# Altium schematic sheet M12_Connector.SchDoc
size A4; DocumentNumber: 1; SheetNumber: 2; SheetTotal: 11
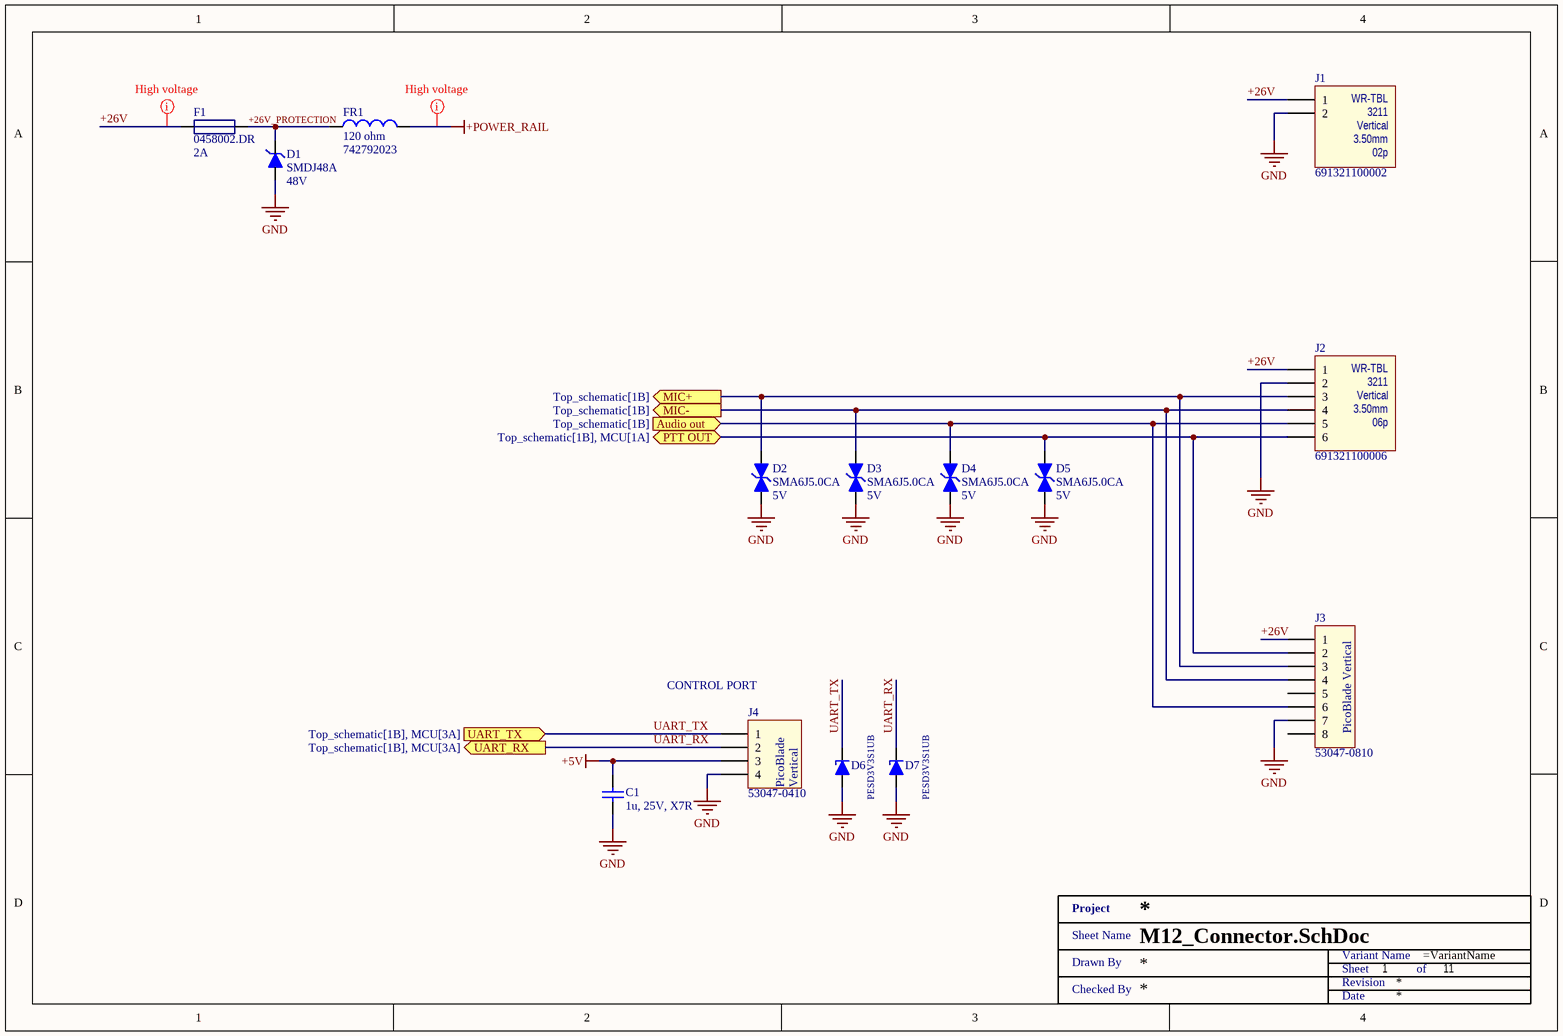
[diagram p0: M12_Connector.SchDoc]

## Parts
C1  1u, 25V, X7R  [SMD0603]
D1  SMDJ48A  Reverse Standoff Voltage: 48V  [DO-214AB]
D2  SMA6J5.0CA  Reverse Standoff Voltage: 5V  [DO-214AC]
D3  SMA6J5.0CA  Reverse Standoff Voltage: 5V  [DO-214AC]
D4  SMA6J5.0CA  Reverse Standoff Voltage: 5V  [DO-214AC]
D5  SMA6J5.0CA  Reverse Standoff Voltage: 5V  [DO-214AC]
D6  PESD3V3S1UB  [SOD523]
D7  PESD3V3S1UB  [SOD523]
F1  0458002.DR  Current Rating: 2A  [SMD1206 - FUSE]
FR1  120 ohm  [SMD0805 - R]
J1  691321100002  [691321100002]
J2  691321100006  [691321100006]
J3  53047-0810  [530470810]
J4  53047-0410  [530470410]
XX?  Title 1  (value not drawn)  (graphical)

## Ports
Audio out (in, see Top_schematic[1B]), MIC+ (out, see Top_schematic[1B]), MIC- (out, see Top_schematic[1B]), PTT OUT (bidir, see Top_schematic[1B], MCU[1A]), UART_RX (out, see Top_schematic[1B], MCU[3A]), UART_TX (in, see Top_schematic[1B], MCU[3A])

## Nets
+5V: C1.1 J4.3
+POWER_RAIL: FR1.2
GND: C1.2 D1.2 D2.1(A) D3.1(A) D4.1(A) D5.1(A) D6.2(K) D7.2(K) J1.2 J2.2 J3.7 J4.4
+26V: F1.1 J1.1 J2.1 J3.1
+26V_PROTECTION: D1.1 F1.2 FR1.1
Audio out: D4.2(K) J2.5 J3.6 ; port Audio out
MIC+: D2.2(K) J2.3 J3.3 ; port MIC+
MIC-: D3.2(K) J2.4 J3.4 ; port MIC-
PTT OUT: D5.2(K) J2.6 J3.2 ; port PTT OUT
UART_RX: D7.1(A) J4.2 ; port UART_RX
UART_TX: D6.1(A) J4.1 ; port UART_TX

Not connected (* = marked no-connect by the designer): J3 5 8

## Layout directives
net class HV: +26V, +POWER_RAIL

## Notes on the sheet
- (near J4) CONTROL PORT
- (in symbol 53047-0410) PicoBlade; Vertical
- (in symbol 53047-0810) PicoBlade Vertical
- (in symbol 691321100002) WR-TBL; 3211; 3.50mm; 02p
- (in symbol 691321100006) WR-TBL; 3211; 3.50mm; 06p
- (in symbol Title 1) Project; Sheet Name; Variant Name; Drawn By; Sheet; of; Revision; Checked By; Date

## Library data of the parts
C1 = CGA3E1X7R1E105K080AC: CAP CER 1UF 25V X7R 0603; Manufacturer: TDK Corporation; Tolerance: ±10%; Manufacturer Part Number: CGA3E1X7R1E105K080AC; RoHS: RoHS Compliant; Category: Capacitors; Stock 1: 109509; Pricing 1: 1=0.2, 10=0.135, 100=0.0686, 500=0.04696, 1000=0.04154 (USD); Packaging: Cut Tape (CT); Part Status: Active; Voltage - Rated: 25V; Temperature Coefficient: X7R; Operating Temperature: -55°C ~ 125°C; Features: -; Ratings: AEC-Q200; Applications: Automotive; Failure Rate: -; Mounting Type: Surface Mount, MLCC; Package / Case: 0603 (1608 Metric); Size / Dimension: 0.063" L x 0.032" W (1.60mm x 0.80mm); Height - Seated (Max): -; Thickness (Max): 0.035" (0.90mm); Lead Spacing: -; Lead Style: -; ComponentLink1URL: https://product.tdk.com/info/en/catalog/datasheets/mlcc_automotive_general_en.pdf; ComponentLink1Description: https://product.tdk.com/info/en/catalog/datasheets/mlcc_automotive_general_en.pdf; Capacitance: 1u; Supplier 1: Mouser; Supplier Part Number 1: 810-CGA3E1X7R1E105K; Supplier 2: Farnell; Supplier Part Number 2: 2346962; Supplier 3: Digi-Key; Supplier Part Number 3: 445-6931-1-ND
D1 = SMDJ48A: J Series 53.3 V 3000 W Surface Mount Uni-Directional TVS Diode - DO-214AB; Manufacturer: Littelfuse; Supplier 1: Mouser; Supplier Part Number 1: 576-SMDJ48A; Manufacturer Part Number: SMDJ48A; RoHS: Yes; Category: TVS Diodes; Stock 1: 11613; Pricing 1: 1=1.02, 10=0.889, 50=0.889, 100=0.688, 1000=0.471, 10000=0.408 (USD); ComponentLink1URL: https://datasheet.ciiva.com/16487/littelfuse-tvs-diodes-smdj-16487926.pdf?src-supplier=Future+Electronics; ComponentLink1Description: https://datasheet.ciiva.com/16487/littelfuse-tvs-diodes-smdj-16487926.pdf?src-supplier=Future+Electronics; ComponentLink2URL: https://datasheet.ciiva.com/332/littelfuse-tvs-diode-smdj-datasheet-pdf-332813.pdf?src-supplier=Digi-Key; ComponentLink2Description: https://datasheet.ciiva.com/332/littelfuse-tvs-diode-smdj-datasheet-pdf-332813.pdf?src-supplier=Digi-Key; ComponentLink3URL: https://datasheet.ciiva.com/332/littelfuse-tvs-diode-smdj-datasheet-pdf-332814.pdf?src-supplier=Digi-Key; ComponentLink3Description: https://datasheet.ciiva.com/332/littelfuse-tvs-diode-smdj-datasheet-pdf-332814.pdf?src-supplier=Digi-Key; ComponentLink4URL: https://datasheet.ciiva.com/332/littelfuse-tvs-diode-smdj-datasheet-pdf-332815.pdf?src-supplier=Digi-Key; ComponentLink4Description: https://datasheet.ciiva.com/332/littelfuse-tvs-diode-smdj-datasheet-pdf-332815.pdf?src-supplier=Digi-Key; Supplier 2: Farnell; Supplier Part Number 2: 2762843; Supplier 3: Digi-Key; Supplier Part Number 3: SMDJ48ACT-ND
D2-D5 = SMA6J5.0CA: ESD Suppressors / TVS Diodes 600W 5V 5% Bi-Directional; Manufacturer: Littelfuse; Supplier 1: Mouser; Supplier Part Number 1: 576-SMA6J5.0CA; Manufacturer Part Number: SMA6J5.0CA; RoHS: Yes; Category: TVS Diodes; Stock 1: 57321; Pricing 1: 1=0.41, 10=0.35, 50=0.35, 100=0.243, 1000=0.139, 10000=0.115 (USD); ComponentLink1URL: http://www.farnell.com/datasheets/2736094.pdf?src-supplier=Farnell; ComponentLink1Description: http://www.farnell.com/datasheets/2736094.pdf?src-supplier=Farnell; ComponentLink2URL: https://datasheet.octopart.com/SMA6J5.0CA-Littelfuse-datasheet-114785799.pdf?src-supplier=Future+Electronics; ComponentLink2Description: https://datasheet.octopart.com/SMA6J5.0CA-Littelfuse-datasheet-114785799.pdf?src-supplier=Future+Electronics; ComponentLink3URL: https://www.littelfuse.com/~/media/electronics/datasheets/tvs_diodes/littelfuse_tvs_diode_sma6j_datasheet.pdf.pdf?src-supplier=Digi-Key; ComponentLink3Description: https://www.littelfuse.com/~/media/electronics/datasheets/tvs_diodes/littelfuse_tvs_diode_sma6j_datasheet.pdf.pdf?src-supplier=Digi-Key; ComponentLink4URL: http://www.farnell.com/datasheets/2736094.pdf?src-supplier=Newark; ComponentLink4Description: http://www.farnell.com/datasheets/2736094.pdf?src-supplier=Newark; ComponentLink5URL: http://www.farnell.com/datasheets/2736094.pdf?src-supplier=Element14; ComponentLink5Description: http://www.farnell.com/datasheets/2736094.pdf?src-supplier=Element14; Supplier 2: Farnell; Supplier Part Number 2: 3010381; Supplier 3: Digi-Key; Supplier Part Number 3: 18-SMA6J5.0CACT-ND
D6 D7 = PESD3V3S1UB,115: TVS DIODE 3.3V 20V SOD523; Manufacturer: Nexperia USA Inc.; Type: Zener; Voltage - Reverse Standoff (Typ): 3.3V (Max); Voltage - Breakdown (Min): 5.2V; Current - Peak Pulse (10/1000µs): 18A (8/20µs); Power - Peak Pulse: 330W; Power Line Protection: No; Capacitance @ Frequency: 207pF @ 1MHz; Manufacturer Part Number: PESD3V3S1UB,115; RoHS: RoHS Compliant; Category: Circuit Protection; Stock 1: 0; Pricing 1: 1=0.49, 10=0.368, 100=0.2082, 500=0.1379, 1000=0.10573 (USD); Packaging: Cut Tape (CT); Part Status: Active; Voltage - Clamping (Max) @ Ipp: 20V; Applications: General Purpose; Operating Temperature: -65°C ~ 150°C (TA); Mounting Type: Surface Mount; Package / Case: SC-79, SOD-523; Supplier Device Package: SOD-523; Base Part Number: PESD*S1U; ComponentLink1URL: https://assets.nexperia.com/documents/data-sheet/PESDXS1UB_SERIES.pdf; ComponentLink1Description: https://assets.nexperia.com/documents/data-sheet/PESDXS1UB_SERIES.pdf; Supplier 1: Mouser; Supplier Part Number 1: 771-PESD3V3S1UB-T/R; Supplier 2: Farnell; Supplier Part Number 2: 8737568; Supplier 3: Digi-Key; Supplier Part Number 3: 1727-3829-1-ND; Supplier 4: TME; Supplier Part Number 4: PESD3V3S1UB.115
F1 = 0458002.DR: FUSE BRD MNT 2A 48VAC 75VDC 1206; Manufacturer: Littelfuse; Body Material: Ceramic; Voltage Rating (AC): 48V; Voltage Rating (DC): 75V; Resistance: 69.5mR; DC Cold Resistance: 63.5mR; Fuse Type: Board Mount (Cartridge Style Excluded); Voltage Rating: 63V; Approvals: cULus; Supplier 1: Mouser; Supplier Part Number 1: 576-0458002.DR; Manufacturer Part Number: 0458002.DR; Stock 1: 11466; Pricing 1: 1 = 1.31000, 10 = 0.97500, 50 = 0.97500, 100 = 0.81200, 1000 = 0.67000, 10000 = 0.50800 (USD); RoHS: Yes; Mount: Surface Mount; Case/Package: 1206; Case Code (Metric): 3216; Case Code (Imperial): 1206; Housing Material: Ceramic; Min Operating Temperature: -55°C; Max Operating Temperature: 125°C; Packaging: Tape and Reel; Package Quantity: 1500; Fuse Current: 2A; Termination: SMD/SMT; Working Voltage: 63V; Length: 0.125inch; Height: 0.062inch; Width: 1.575mm; Depth: 1.58mm; REACH SVHC: No SVHC; Lead Free: Lead Free; ComponentLink1URL: https://datasheet.ciiva.com/1730/337915-1730544.pdf?src-supplier=Newark; ComponentLink1Description: https://datasheet.ciiva.com/1730/337915-1730544.pdf?src-supplier=Newark; ComponentLink2URL: https://datasheet.ciiva.com/299/littelfuse-fuse-458-series-299804.pdf?src-supplier=Digi-Key; ComponentLink2Description: https://datasheet.ciiva.com/299/littelfuse-fuse-458-series-299804.pdf?src-supplier=Digi-Key; ComponentLink3URL: https://datasheet.ciiva.com/299/littelfuse-fuse-458-series-299805.pdf?src-supplier=Digi-Key; ComponentLink3Description: https://datasheet.ciiva.com/299/littelfuse-fuse-458-series-299805.pdf?src-supplier=Digi-Key; ComponentLink4URL: https://datasheet.ciiva.com/299/littelfuse-fuse-458-series-299806.pdf?src-supplier=Digi-Key; ComponentLink4Description: https://datasheet.ciiva.com/299/littelfuse-fuse-458-series-299806.pdf?src-supplier=Digi-Key; Supplier 2: Farnell; Supplier Part Number 2: 1702533; Stock 2: 1620; Supplier 3: Digi-Key; Supplier Part Number 3: F2931CT-ND; Stock 3: 14221; Pricing 3: 1 = 1.43000, 5 = 1.38400, 10 = 1.29500, 50 = 1.07180, 100 = 0.89320, 250 = 0.87088, 500 = 0.73690 (USD)
FR1 = 742792023: WURTH ELEKTRONIK - 742792023 - FERRITE BEAD, 0.03OHM, 3A, 0805; Impedance @ 100MHz: 120; Ferrite Case Style: 0805 [2012 Metric]; DC Current Rating: 3; DC Resistance Max: 0.03; Impedance Tolerance: ± 25%; Ferrite Mounting: SMD; Resistance: 0.03ohm<!--FANDB--><div class="features-and-benefits-container"><div class="features-and-benefits-description"><span class="features-benefits-value">The 742792023 is a SMD EMI Suppression Ferrite Bead with 0805 case and reliable Ni-Sn electrodes. It can be put directly on the printed circuit board. It offers excellent anti-EMI properties and low DC resistance. Placed very close next to the interference source even with smallest size 0402, maximal impedance at 1000; Manufacturer: WURTH ELEKTRONIK; RoHS: YES; Stock 1: 4283; Pricing 1: 1=0,123, 50=0,112, 100=0,103, 500=0,0937, 1000=0,0877, 2000=0,0846 (GBP); Product Range: -; Automotive Qualification Standard: -; Packaging: Cut Tape; ComponentLink1URL: http://www.farnell.com/datasheets/1695980.pdf; ComponentLink1Description: http://www.farnell.com/datasheets/1695980.pdf; ComponentLink2URL: http://www.farnell.com/cad/1670054.zip; ComponentLink2Description: http://www.farnell.com/cad/1670054.zip; Supplier 1: Mouser; Supplier Part Number 1: 710-742792023; Supplier 2: Farnell; Supplier Part Number 2: 1635732; Supplier 3: Digi-Key; Supplier Part Number 3: 732-1613-1-ND; Manufacturer Part Number: 742792023
J1 = 691321100002: WR-TBL Series 3211 - 3.50 mm Vertical PCB Header; Manufacturer: Wurth Electronics; Description: Barrier Strip Terminal Block, 10A, 1 Row(s), 1 Deck(s); Number of Positions Per Level: 2; Number of Levels: 1; Current: 10A; Voltage: 300V; Pitch: 0.138inch; Supplier: Mouser; Supplier Part Number: 710-691321100002; Manufacturer Part Number: 691321100002; RoHS: Yes; Category: Terminal Blocks; Stock: 2512; Pricing: 1=0.44, 10=0.394, 50=0.34, 100=0.305, 1000=0.269, 10000=0.268 (USD); Mounting Technology: Through Hole; Color: Green; Contact Material: Brass; Package Quantity: 1000; Packaging: Bulk; Number of Rows: 1; Termination: Solder; Number of Contacts: 2; Orientation: Vertical; Series: WR-TBL Series 3211; Voltage Rating: 300V; Length: 7mm; Width: 8.1mm; Height: 12.7mm; RoHS Compliant: Yes; Reach SVHC Compliant: Unknown; Lead Free: 5697LeadFree; ComponentLink1URL: https://datasheet.ciiva.com/8043/1442231-8043542.pdf?src-supplier=Element14; ComponentLink1Description: https://datasheet.ciiva.com/8043/1442231-8043542.pdf?src-supplier=Element14; ComponentLink2URL: https://datasheet.ciiva.com/795/6913211000xx-795780.pdf?src-supplier=Digikey; ComponentLink2Description: https://datasheet.ciiva.com/795/6913211000xx-795780.pdf?src-supplier=Digikey; ComponentLink3URL: https://datasheet.ciiva.com/48692/001088697-da-01-en-wr-tbl-terminal-block3211-691321100002-48692842.pdf?src-supplier=Conrad; ComponentLink3Description: https://datasheet.ciiva.com/48692/001088697-da-01-en-wr-tbl-terminal-block3211-691321100002-48692842.pdf?src-supplier=Conrad; Supplier 1: Mouser; Supplier Part Number 1: 710-691321100002; Supplier 2: Farnell; Supplier Part Number 2: 1841308; Supplier 3: Digikey; Supplier Part Number 3: 732-2763-ND
J2 = 691321100006: WR-TBL Series 3211 - 3.50 mm Vertical PCB Header; Manufacturer: Wurth Electronics; Description: Barrier Strip Terminal Block, 10A, 1 Row(s), 1 Deck(s); Current Rating: 10.5A; Number of Positions Per Level: 6; Number of Levels: 1; Current: 10A; Voltage: 300V; Pitch: 0.138inch; Supplier: Mouser; Supplier Part Number: 710-691321100006; Manufacturer Part Number: 691321100006; RoHS: Yes; Category: Terminal Blocks; Stock: 612; Pricing: 1=1.32, 10=1.18, 50=1.02, 100=0.914, 1000=0.805, 10000=0.804 (USD); Mounting Technology: Through Hole; Color: Green; Contact Material: Brass; Number of Rows: 1; Package Quantity: 520; Packaging: Bulk; Termination: Solder; Number of Contacts: 6; Contact Gender: Male; Orientation: Vertical; Series: WR-TBL Series 3211; Length: 7mm; Width: 25.6mm; Height: 12.7mm; RoHS Compliant: Yes; Reach SVHC Compliant: Unknown; ComponentLink1URL: https://datasheet.ciiva.com/8043/1442231-8043549.pdf?src-supplier=Element14; ComponentLink1Description: https://datasheet.ciiva.com/8043/1442231-8043549.pdf?src-supplier=Element14; ComponentLink2URL: https://datasheet.ciiva.com/796/6913211000xx-796060.pdf?src-supplier=Digikey; ComponentLink2Description: https://datasheet.ciiva.com/796/6913211000xx-796060.pdf?src-supplier=Digikey; ComponentLink3URL: https://datasheet.ciiva.com/48692/001088701-da-01-en-wr-tbl-terminal-block3211-691321100006-48692844.pdf?src-supplier=Conrad; ComponentLink3Description: https://datasheet.ciiva.com/48692/001088701-da-01-en-wr-tbl-terminal-block3211-691321100006-48692844.pdf?src-supplier=Conrad; Supplier 1: Mouser; Supplier Part Number 1: 710-691321100006; Supplier 2: Farnell; Supplier Part Number 2: 1841313; Supplier 3: Digikey; Supplier Part Number 3: 732-2767-ND
J3 = 53047-0810: 1.25mm Pitch, PicoBlade PCB Header, Single Row, Vertical, Through Hole, Tin Plating, Friction Lock, 8 Circuits, Tray, 2.30mm PC Tail Length; Manufacturer: Molex; Number of Contacts: 8; Contact Resistance: 20mR; Gender: Male; Current Rating: 1A; Voltage Rating: 125V; Insulation Resistance: 100MR; Glow Wire Compliant: Non-compliant; Supplier 1: Mouser; Supplier Part Number 1: 538-53047-0810; Manufacturer Part Number: 53047-0810; Stock 1: 13800; Pricing 1: 1 = 0.50000, 10 = 0.48300, 50 = 0.48300, 100 = 0.38300, 1000 = 0.29100, 10000 = 0.22600 (USD); RoHS: Yes; Mount: Through Hole; Case/Package: 0810; Contact Plating: Tin; Contact Material: Bronze; Color: Natural; Housing Color: Natural; Housing Material: Polyamide; Min Operating Temperature: -40°C; Max Operating Temperature: 85°C; Termination: Through Hole; Number of Rows: 1; Orientation: Vertical; Packaging: Tray; Number of Positions: 8; Package Quantity: 2000; Voltage Rating (DC): 125V; Number of Circuits: 8; Pitch: 1.25mm; Radiation Hardening: No; REACH SVHC: Unknown; Lead Free: Lead Free; Flammability Rating: UL94 V-0; ComponentLink1URL: https://datasheet.ciiva.com/30110/64290530470810-pcb-headers-30110449.pdf?src-supplier=Onlinecomponents.com; ComponentLink1Description: https://datasheet.ciiva.com/30110/64290530470810-pcb-headers-30110449.pdf?src-supplier=Onlinecomponents.com; ComponentLink2URL: https://datasheet.ciiva.com/5155/0530470810-pcb-headers-170988-5155236.pdf?src-supplier=Mouser; ComponentLink2Description: https://datasheet.ciiva.com/5155/0530470810-pcb-headers-170988-5155236.pdf?src-supplier=Mouser; ComponentLink3URL: https://datasheet.ciiva.com/11747/0900766b8024e2fd-11747012.pdf?src-supplier=RSComponents; ComponentLink3Description: https://datasheet.ciiva.com/11747/0900766b8024e2fd-11747012.pdf?src-supplier=RSComponents; ComponentLink4URL: https://datasheet.ciiva.com/25291/1815828-25291355.pdf?src-supplier=Newark; ComponentLink4Description: https://datasheet.ciiva.com/25291/1815828-25291355.pdf?src-supplier=Newark; ComponentLink5URL: https://datasheet.ciiva.com/34303/1932504-34303339.pdf?src-supplier=Jameco; ComponentLink5Description: https://datasheet.ciiva.com/34303/1932504-34303339.pdf?src-supplier=Jameco; ComponentLink6URL: https://datasheet.ciiva.com/16658/0530470810-pcb-headers-16658422.pdf?src-supplier=Avnet+Europe; ComponentLink6Description: https://datasheet.ciiva.com/16658/0530470810-pcb-headers-16658422.pdf?src-supplier=Avnet+Europe; ComponentLink7URL: https://datasheet.ciiva.com/17025/70266944-17025467.pdf?src-supplier=Allied+Electronics; ComponentLink7Description: https://datasheet.ciiva.com/17025/70266944-17025467.pdf?src-supplier=Allied+Electronics; ComponentLink8URL: https://datasheet.ciiva.com/14156/ge116819-116832-e-14156239.pdf?src-supplier=Distrelec; ComponentLink8Description: https://datasheet.ciiva.com/14156/ge116819-116832-e-14156239.pdf?src-supplier=Distrelec; Supplier 2: Avnet; Supplier Part Number 2: 0530470810; Stock 2: 6079; Pricing 2: 1 = 0.24815, 10 = 0.22867, 25 = 0.21440, 50 = 0.20775, 100 = 0.20181 (USD); Supplier 3: Farnell; Supplier Part Number 3: 1012258; Stock 3: 17670; Supplier 4: Arrow; Supplier Part Number 4: 53047-0810; Stock 4: 10054; Pricing 4: 1 = 0.35700, 10 = 0.34100, 100 = 0.26730, 500 = 0.24440, 2000 = 0.21170, 6000 = 0.19700, 10000 = 0.18630, 1 = 0.58990, 10 = 0.54650, 100 = 0.37790, 500 = 0.32560, 2000 = 0.25820, 6000 = 0.24640, 2000 = 0.30960, 1 = 0.56010, 10 = 0.53030, 100 = 0.39670, 500 = 0.39230 (USD); Supplier 5: Digi-Key; Supplier Part Number 5: WM1737-ND; Stock 5: 16575; Pricing 5: 1 = 0.54000, 10 = 0.50500, 100 = 0.38690, 500 = 0.33644, 2000 = 0.26915, 6000 = 0.24392, 10000 = 0.22710 (USD)
J4 = 53047-0410: 1.25mm Pitch, PicoBlade PCB Header, Single Row, Vertical, Through Hole, Tin Plating, Friction Lock, 4 Circuits, Tray, 2.30mm PC Tail Length; Manufacturer: Molex; Manufacturer Part Number: 0530470410; Number of Positions: 4; Max Voltage Rating (AC): 125V; Contact Resistance: 20mR; Connector Type: Blade Pin; RoHS: Yes; Category: Headers and Wire Housings; Stock 4: 7971; Pricing 4: 1=0,27000, 10=0,23400, 100=0,18000, 500=0,15400, 1000=0,13000, 5000=0,11200, 10000=0,10400 (USD); Mount: Through Hole; Housing Material: Nylon; Contact Plating: Tin; Contact Material: Bronze; Color: Natural; Housing Color: White; Min Operating Temperature: -40°C; Max Operating Temperature: 85°C; Termination: Solder; Number of Contacts: 4; Packaging: Tray; Number of Rows: 1; Orientation: Straight; Length: 6.75mm; Pitch: 1.25mm; Contact Mating Length: 0.089inch; Depth: 3.2mm; ComponentLink1URL: https://datasheet.ciiva.com/3934/87920530470410-pcb-headers-3934064.pdf?src-supplier=Arrow; ComponentLink1Description: https://datasheet.ciiva.com/3934/87920530470410-pcb-headers-3934064.pdf?src-supplier=Arrow; Supplier 1: Mouser; Supplier Part Number 1: 538-53047-0410; Supplier 2: Farnell; Supplier Part Number 2: 9733060; Supplier 3: Digi-Key; Supplier Part Number 3: WM1733-ND; Supplier 4: Avnet; Supplier Part Number 4: 0530470410